# Altium schematic sheet TOP.SchDoc
size A4
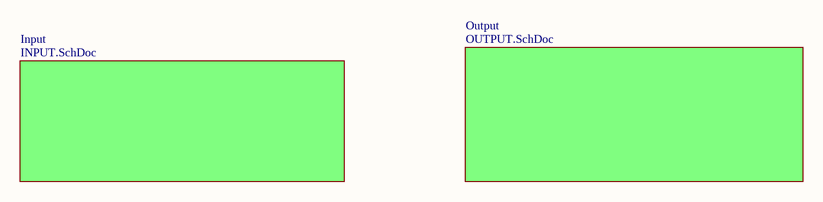
[diagram p0: TOP.SchDoc]

## Sub-sheets
Input = INPUT.SchDoc: no entries
Output = OUTPUT.SchDoc: no entries